# Altium schematic sheet Main.SchDoc
size A; SheetNumber: 1; SheetTotal: 7
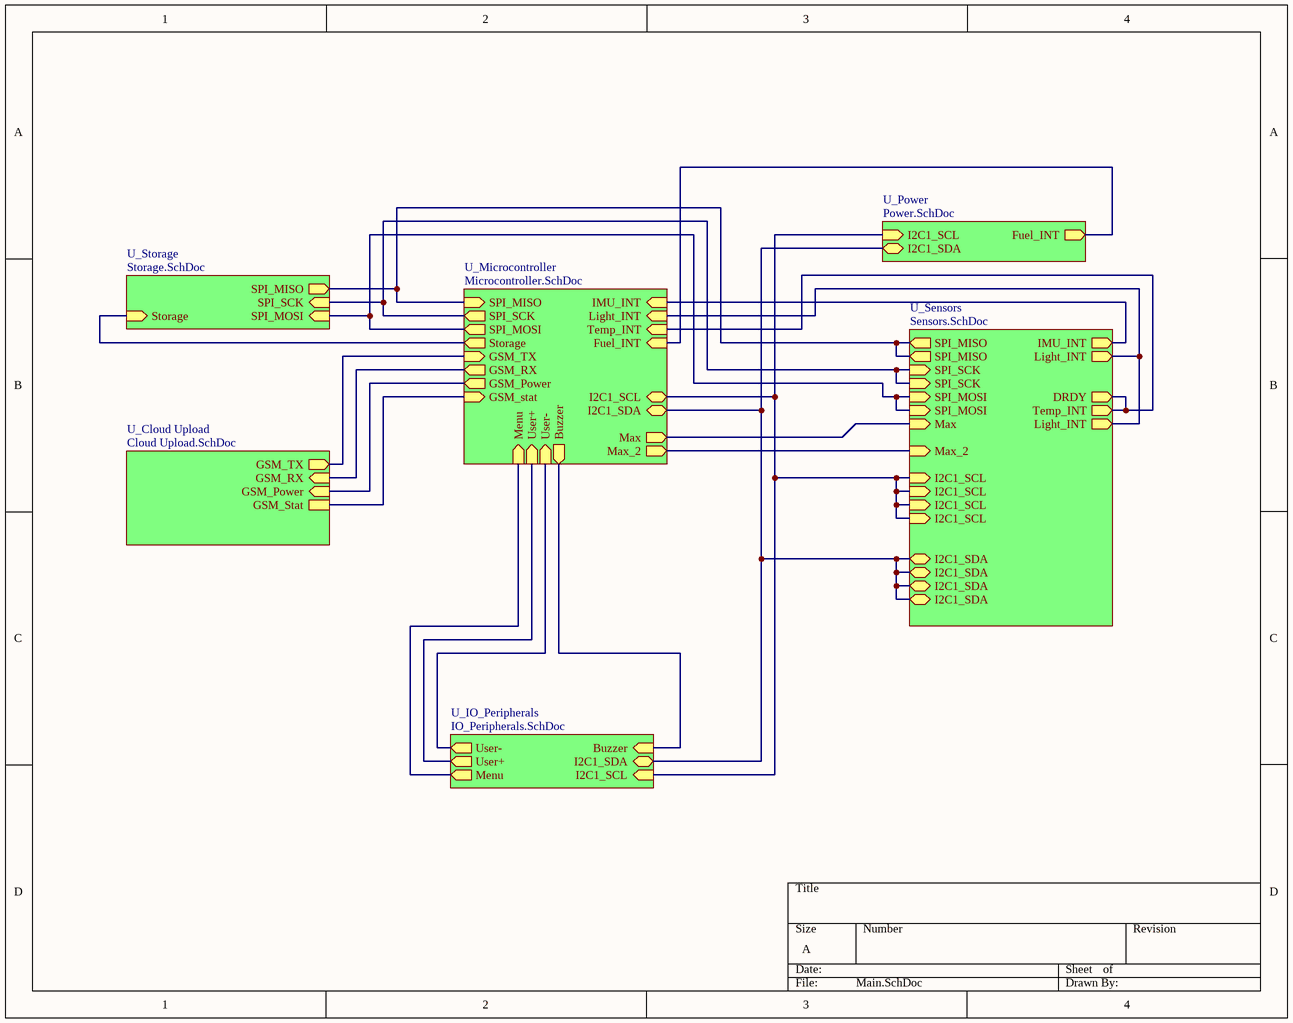
[diagram p0: Main.SchDoc]

## Sub-sheets
U_Cloud Upload = Cloud Upload.SchDoc: GSM_TX (out), GSM_RX (in), GSM_Power (in), GSM_Stat
U_IO_Peripherals = IO_Peripherals.SchDoc: I2C1_SCL (in), I2C1_SDA (bidir), Buzzer (in), Menu (out), User+ (out), User- (out)
U_Microcontroller = Microcontroller.SchDoc: SPI_MISO (in), SPI_SCK (out), SPI_MOSI (out), IMU_INT (in), I2C1_SCL (bidir), I2C1_SDA (bidir), Max (out), Max_2 (out), Light_INT (in), Temp_INT (in), Fuel_INT (in), Menu (in), User+ (in), User- (in), Buzzer (out), GSM_stat (in), GSM_RX (out), GSM_Power (out), GSM_TX (in), Storage (out)
U_Power = Power.SchDoc: I2C1_SCL (in), I2C1_SDA (bidir), Fuel_INT (out)
U_Sensors = Sensors.SchDoc: IMU_INT (out), Light_INT (out), DRDY (out), Temp_INT (out), Light_INT (out), I2C1_SDA (bidir), I2C1_SCL (in), Max_2 (in), Max (in), SPI_MOSI (in), SPI_SCK (in), SPI_MISO (out), SPI_MISO (out), SPI_SCK (in), SPI_MOSI (in), I2C1_SCL (in), I2C1_SCL (in), I2C1_SCL (in), I2C1_SDA (bidir), I2C1_SDA (bidir), I2C1_SDA (bidir)
U_Storage = Storage.SchDoc: SPI_MISO (out), SPI_SCK (in), SPI_MOSI (in), Storage (in)

## Nets
(unnamed): sheet U_Power/I2C1_SCL, sheet U_Microcontroller/I2C1_SCL, sheet U_Sensors/I2C1_SCL, sheet U_Sensors/I2C1_SCL, sheet U_Sensors/I2C1_SCL, sheet U_Sensors/I2C1_SCL, sheet U_IO_Peripherals/I2C1_SCL
(unnamed): sheet U_Power/I2C1_SDA, sheet U_Microcontroller/I2C1_SDA, sheet U_Sensors/I2C1_SDA, sheet U_Sensors/I2C1_SDA, sheet U_Sensors/I2C1_SDA, sheet U_Sensors/I2C1_SDA, sheet U_IO_Peripherals/I2C1_SDA
(unnamed): sheet U_Power/Fuel_INT, sheet U_Microcontroller/Fuel_INT
(unnamed): sheet U_Microcontroller/SPI_MISO, sheet U_Sensors/SPI_MISO, sheet U_Sensors/SPI_MISO, sheet U_Storage/SPI_MISO
(unnamed): sheet U_Microcontroller/SPI_SCK, sheet U_Sensors/SPI_SCK, sheet U_Sensors/SPI_SCK, sheet U_Storage/SPI_SCK
(unnamed): sheet U_Microcontroller/SPI_MOSI, sheet U_Sensors/SPI_MOSI, sheet U_Sensors/SPI_MOSI, sheet U_Storage/SPI_MOSI
(unnamed): sheet U_Microcontroller/IMU_INT, sheet U_Sensors/IMU_INT
(unnamed): sheet U_Microcontroller/Max, sheet U_Sensors/Max
(unnamed): sheet U_Microcontroller/Max_2, sheet U_Sensors/Max_2
(unnamed): sheet U_Microcontroller/Light_INT, sheet U_Sensors/Light_INT, sheet U_Sensors/Light_INT
(unnamed): sheet U_Microcontroller/Temp_INT, sheet U_Sensors/DRDY, sheet U_Sensors/Temp_INT
(unnamed): sheet U_Microcontroller/Menu, sheet U_IO_Peripherals/Menu
(unnamed): sheet U_Microcontroller/User+, sheet U_IO_Peripherals/User+
(unnamed): sheet U_Microcontroller/User-, sheet U_IO_Peripherals/User-
(unnamed): sheet U_Microcontroller/Buzzer, sheet U_IO_Peripherals/Buzzer
(unnamed): sheet U_Microcontroller/GSM_stat, sheet U_Cloud Upload/GSM_Stat
(unnamed): sheet U_Microcontroller/GSM_RX, sheet U_Cloud Upload/GSM_RX
(unnamed): sheet U_Microcontroller/GSM_Power, sheet U_Cloud Upload/GSM_Power
(unnamed): sheet U_Microcontroller/GSM_TX, sheet U_Cloud Upload/GSM_TX
(unnamed): sheet U_Microcontroller/Storage, sheet U_Storage/Storage